# Altium schematic sheet front2ch.SchDoc
size A4
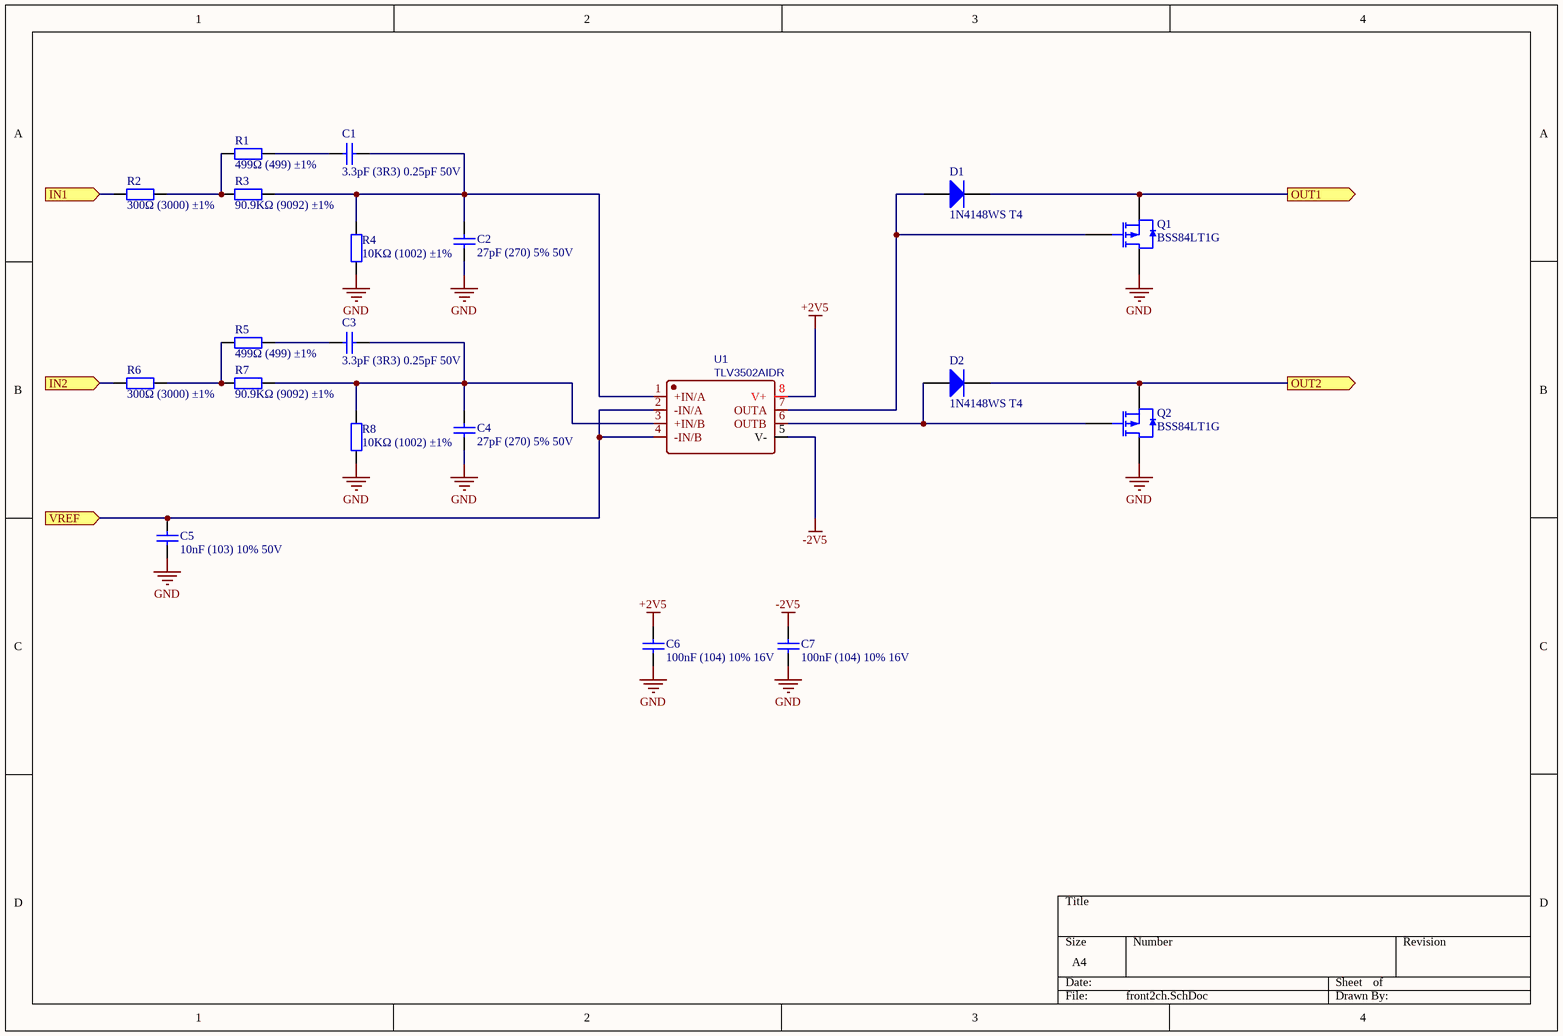
[diagram p0: front2ch.SchDoc]

## Parts
C1  3.3pF (3R3) 0.25pF 50V  [0402_C]
C2  27pF (270) 5% 50V  [0402_C]
C3  3.3pF (3R3) 0.25pF 50V  [0402_C]
C4  27pF (270) 5% 50V  [0402_C]
C5  10nF (103) 10% 50V  [0402_C]
C6  100nF (104) 10% 16V  [0402_C]
C7  100nF (104) 10% 16V  [0402_C]
D1  1N4148WS T4  [SOD-323]
D2  1N4148WS T4  [SOD-323]
Q1  BSS84LT1G  [SOT-23(SOT-23-3)]
Q2  BSS84LT1G  [SOT-23(SOT-23-3)]
R1  499Ω (499) ±1%  [0402_R]
R2  300Ω (3000) ±1%  [0402_R]
R3  90.9KΩ (9092) ±1%  [0402_R]
R4  10KΩ (1002) ±1%  [0402_R]
R5  499Ω (499) ±1%  [0402_R]
R6  300Ω (3000) ±1%  [0402_R]
R7  90.9KΩ (9092) ±1%  [0402_R]
R8  10KΩ (1002) ±1%  [0402_R]
U1  TLV3502AIDR  [SOIC-8_150mil]

## Ports
IN1 (in), IN2 (in), OUT1 (out), OUT2 (out), VREF (in)

## Nets
+2V5: C6.2 U1.8(V+)
-2V5: C7.2 U1.5(V-)
GND: C2.1 C4.1 C5.1 C6.1 C7.1 Q1.3(D) Q2.3(D) R4.1 R8.1
IN1: R2.1 ; port IN1
IN2: R6.1 ; port IN2
OUT1: D1.2(K) Q1.2(S) ; port OUT1
OUT2: D2.2(K) Q2.2(S) ; port OUT2
VREF: C5.2 U1.2(-IN/A) U1.4(-IN/B) ; port VREF
NetC1_1: C1.1 R1.2
NetC1_2: C1.2 C2.2 R3.2 R4.2 U1.1(+IN/A)
NetC3_1: C3.1 R5.2
NetC3_2: C3.2 C4.2 R7.2 R8.2 U1.3(+IN/B)
NetD1_1: D1.1(A) Q1.1(G) U1.7(OUTA)
NetD2_1: D2.1(A) Q2.1(G) U1.6(OUTB)
NetR1_1: R1.1 R2.2 R3.1
NetR5_1: R5.1 R6.2 R7.1

## Library data of the parts
C1 C3 = 0402 3.3pF (3R3) 0.25pF 50V: 贴片电容; ComponentLink1Description: 供应商链接; ComponentLink1URL: http://www.szlcsc.com/product/details_1917.html; Package: 0402; Supplier: LC; SuppliersPartNumber: C1565
C2 C4 = 0402 27pF (270) 5% 50V: 贴片电容; ComponentLink1Description: 供应商链接; ComponentLink1URL: http://www.szlcsc.com/product/details_1909.html; Package: 0402; Supplier: LC; SuppliersPartNumber: C1557
C5 = 0402 10nF (103) 10% 50V: 贴片电容; ComponentLink1Description: 供应商链接; ComponentLink1URL: http://www.szlcsc.com/product/details_15869.html; Package: 0402; Supplier: LC; SuppliersPartNumber: C15195
C6 C7 = 0402 100nF (104) 10% 16V: 贴片电容; ComponentLink1Description: 供应商链接; ComponentLink1URL: http://www.szlcsc.com/product/details_1877.html; Package: 0402; Supplier: LC; SuppliersPartNumber: C1525
D1 D2 = SOD-323 1N4148WS T4: 二极管; ComponentLink1Description: 供应商链接; ComponentLink1URL: http://www.szlcsc.com/product/details_2485.html; Package: SOD-323; Supplier: LC; SuppliersPartNumber: C2128
Q1 Q2 = BSS84LT1G: MOS(场效应管); ComponentLink1Description: 供应商链接; ComponentLink1URL: http://www.szlcsc.com/product/details_8986.html; Package: SOT-23(SOT-23-3); Supplier: LC; SuppliersPartNumber: C8492
R1 R5 = 0402 49.9Ω (49R9) 1%: 贴片电阻; ComponentLink1Description: 供应商链接; ComponentLink1URL: http://www.szlcsc.com/product/details_25863.html; Package: 0402; Supplier: LC; SuppliersPartNumber: C57982
R2 R6 = 0402 300Ω (3000) 1%: 贴片电阻; ComponentLink1Description: 供应商链接; ComponentLink1URL: http://www.szlcsc.com/product/details_25845.html; Package: 0402; Supplier: LC; SuppliersPartNumber: C25102
R3 R7 = 0402 8.2KΩ (8201) 1%: 贴片电阻; ComponentLink1Description: 供应商链接; ComponentLink1URL: http://www.szlcsc.com/product/details_26667.html; Package: 0402; Supplier: LC; SuppliersPartNumber: C26989
R4 R8 = 0402 10KΩ (1002) 1%: 贴片电阻; ComponentLink1Description: 供应商链接; ComponentLink1URL: http://www.szlcsc.com/product/details_26487.html; Package: 0402; Supplier: LC; SuppliersPartNumber: C25744
U1 = TLV3502AIDR: BOM_Manufacturer: TI; Contributor: LCSC; SMT Type: Extend; BOM_Supplier: LCSC; BOM_Manufacturer Part: TLV3502AIDR; BOM_Supplier Part: C131165; BOM_LCSC Assembly: Yes; spicePre: U; spiceSymbolName: TLV3502AIDR